# Altium project BusinessCardPCB.PrjPcb
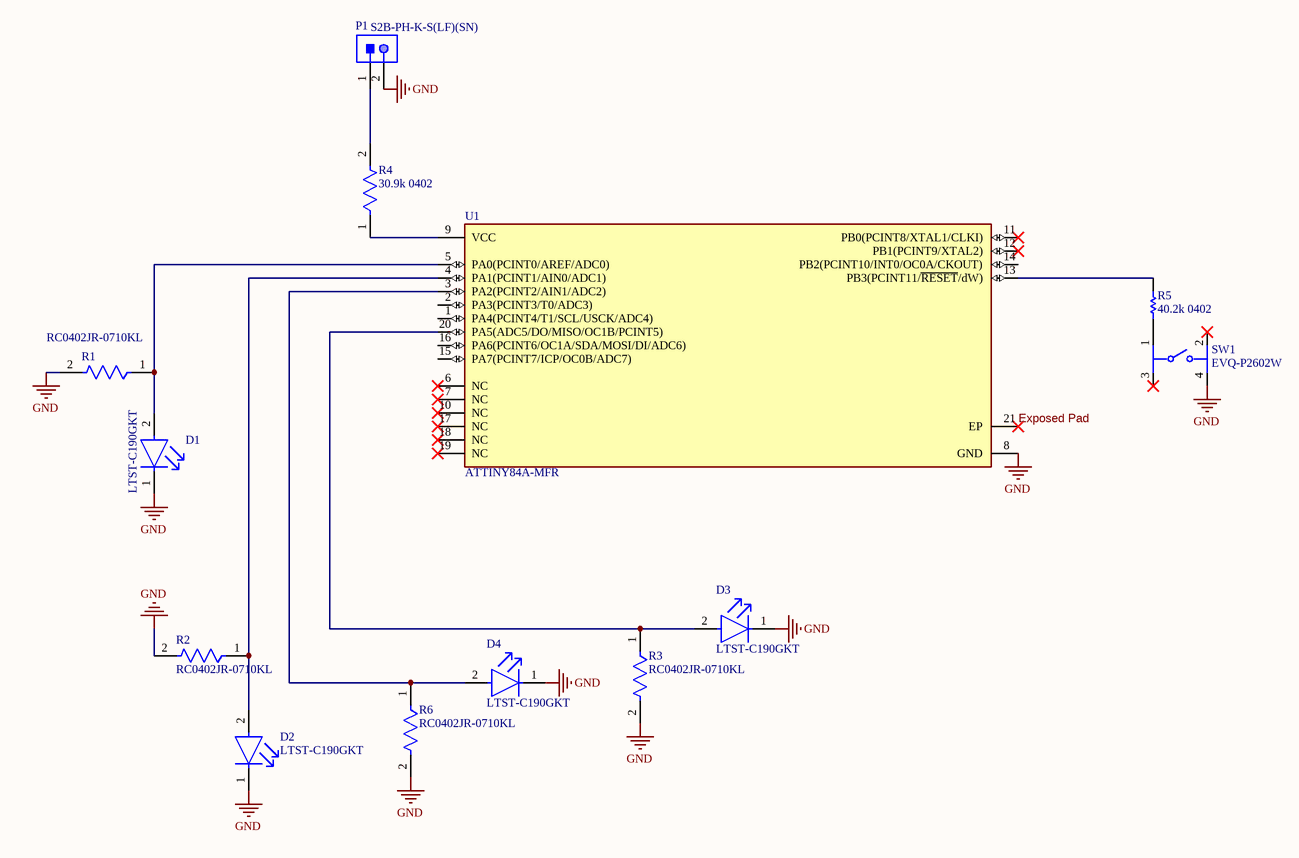
[diagram p0: BusinessCardPCB.SchDoc]
1 sheet, 13 parts. Net scope: global (net labels, ports and power ports of the same name join across sheets).
Board file: BusinessCardPCB.PcbDoc

## Sheet BusinessCardPCB.SchDoc
size A2; SheetNumber: 1; SheetTotal: 1

### Parts
D1  LTST-C190GKT  [FP-LTST-C190GKT-MFG]
D2  LTST-C190GKT  [FP-LTST-C190GKT-MFG]
D3  LTST-C190GKT  [FP-LTST-C190GKT-MFG]
D4  LTST-C190GKT  [FP-LTST-C190GKT-MFG]
P1  S2B-PH-K-S(LF)(SN)  [JST-S2B-PH-K-S_V]
R1  RC0402JR-0710KL  [FP-RC0402-0_4-IPC_C]
R2  RC0402JR-0710KL  [FP-RC0402-0_4-IPC_C]
R3  RC0402JR-0710KL  [FP-RC0402-0_4-IPC_C]
R4  30.9k 0402  [FP-RT0402-MFG]
R5  40.2k 0402  [RESC1005X40X25ML05T10]
R6  RC0402JR-0710KL  [FP-RC0402-0_4-IPC_C]
SW1  EVQ-P2602W  [FP-EVQ-P2602W-MFG]
U1  ATTINY84A-MFR  [FP-C04-21443-MFG]

### Nets
GND: D1.1(C) D2.1(C) D3.1(C) D4.1(C) P1.2 R1.2 R2.2 R3.2 R6.2 SW1.4 U1.8(GND)
Exposed Pad: U1.21(EP)
NetD1_2: D1.2(A) R1.1 U1.5(PA0(PCINT0/AREF/ADC0))
NetD2_2: D2.2(A) R2.1 U1.4(PA1(PCINT1/AIN0/ADC1))
NetD3_2: D3.2(A) R3.1 U1.20(PA5(ADC5/DO/MISO/OC1B/PCINT5))
NetD4_2: D4.2(A) R6.1 U1.3(PA2(PCINT2/AIN1/ADC2))
NetP1_1: P1.1 R4.2
NetR4_1: R4.1 U1.9(VCC)
NetR5_1: R5.1 SW1.1
NetR5_2: R5.2 U1.13(PB3(PCINT11/~{RESET}/dW))

Not connected (* = marked no-connect by the designer): SW1 2* 3*; U1 1(PA4(PCINT4/T1/SCL/USCK/ADC4)) 2(PA3(PCINT3/T0/ADC3)) 6(NC)* 7(NC)* 10(NC)* 11(PB0(PCINT8/XTAL1/CLKI))* 12(PB1(PCINT9/XTAL2))* 14(PB2(PCINT10/INT0/OC0A/CKOUT)) 15(PA7(PCINT7/ICP/OC0B/ADC7)) 16(PA6(PCINT6/OC1A/SDA/MOSI/DI/ADC6)) 17(NC)* 18(NC)* 19(NC)*

### Library data of the parts
D1-D4 = CMP-22017-000005-2: LED GREEN CLEAR CHIP SMD; Dominant Wavelength: 569nm; Reverse Voltage: 5V; Lens Color: Colorless; Viewing Angle: 130°; Voltage: 2V; Forward Current: 30mA; Power Dissipation: 100mW; Luminous Intensity: 6mcd; Number of LEDs: 1; Forward Voltage: 2.1V; Wavelength: 565nm; Test Current: 10mA; Min Operating Temperature: -55°C; Lens Style: Clear; Mount: Surface Mount; Width: 0.8mm; Packaging: Tape and Reel; Lens Transparency: Clear; Case Code (Metric): 1608; Depth: 0.8mm; Case Code (Imperial): 0603; Case/Package: 0603; Number of Pins: 2; Max Operating Temperature: 85°C; Lead Free: Lead Free; Number of Elements: 1; Length: 1.6mm; Height: 0.8mm; Package Quantity: 1; Power Rating: 100mW; Radiation Hardening: No; Illumination Color: Green; Color: Green
P1 = CMP-1755-00004-1: Male Header, Pitch 2 mm, 1 x 2 Position, Height 4.8 mm, Tail Length 3.4 mm, -25 to 85 degC, RoHS, Bulk; Case\Package: Radial; Tolerance: 20%; Capacitance: 10 uF; Voltage Rating (DC): 50 V; Packaging: Bulk; ComponentLink1URL: http://www.jst-mfg.com/product/pdf/eng/ePH.pdf; Radiation Hardening: No; Height: 11 mm; Package Quantity: 200; PackageDescription: Male Header, Pitch 2 mm, 1 x 2 Position, Height 4.8 mm, Tail Length 3.4 mm; PackageReference: S2B-PH-K-S; Diameter: 5 mm; Pins: 2; Mount: Through Hole; Max Operating Temperature: 85 degC; Min Operating Temperature: -40 degC; ComponentLink1Description: Datasheet; DatasheetVersion: Dec-12; Length: 11 mm; Lead Pitch: 2 mm; REACH SVHC: No SVHC; Voltage Rating: 50 V; RoHSCompliant: true
R1-R3 R6 = CMP-2002-07915-3: RES 10K OHM 5% 1/16W 0402; Max Power Dissipation: 63mW; Temperature Coefficient: 100ppm/°C; Power Rating: 62.5mW; Resistance: 10kR; Voltage Rating: 50V; Size Code: 0402; Resistance Tolerance: 5%; Packaging: Tape and Reel; Case Code (Metric): 1005; Lead Free: Lead Free; Resistor Type: Thick Film; Min Operating Temperature: -55°C; Military Standard: Not; Depth: 0.5mm; Series: RC; Case/Package: 0402; Construction: Rectangular; Number of Terminations: 2; Package Quantity: 1; Termination: SMD/SMT; Length: 0.039inch; Case Code (Imperial): 0402; Height: 0.016inch; Features: Moisture Resistant; RoHS Compliant: Yes; Max Operating Temperature: 155°C; Tolerance: 5%; Width: 0.02inch
R4 = CMP-03412-014653-1: RES SMD 30.9KOHM 0.1% 1/16W 0402; Manufacturer Part Number: RT0402BRE0730K9L; Manufacturer: Yageo; Value: 30.9KΩ; Power Rating: 0.063W; Temperature Coefficient: 50 ppm/°C; Tolerance: 0.001; Voltage Rating: 50V; Lead Free: Yes; Device Class L1: Passive Components; RoHS: TRUE; Device Class L3: Chip SMD Resistors; Package: RT0402; Automotive: No; Series: RT; Footprint Url: http://www.yageo.com/exep/pages/download/literatures/PYu-R_Mount_10.pdf; Resistance: 30.9KΩ; ComponentLink2URL: http://www.yageo.com/documents/recent/PYu-RT_1-to-0.01_RoHS_L_9.pdf; Category: Res; Height: 0.35mm; Temperature Range Low: -55°C; Device Class L2: Resistors; ComponentLink2Description: Datasheet; Composition: Thin Film; Temperature: -55°C to +155°C; Ipc Land Pattern Name: RESC10050X30; Octopart: https://octopart.com/rt0402bre0730k9l-yageo-1370119; Temperature Range High: +155°C; Digikey Description: RES SMD 30.9KOHM 0.1% 1/16W 0402
R5 = CMP-2002-07676-1: Part Number: RC0402FR-0740K2L; Manufacturer: Yageo / Phycomp
SW1 = CMP-00287-39836447-1: EVQ-P2602W Switch Tactile N.O. SPST Button J-Bend 0.02A 15VDC 3.5N SMD Automotive Embossed T/R; Switch Function: Off-Mom; Contact Current Rating: 20mA; Contact Resistance: 100mΩ; Actuator Length: 850µm; Max Voltage Rating (DC): 15V; Electrical Life: 200kcycles; Switch Travel: 250µm; Number of Positions: 2; Illumination Type: Illuminated, Non-Illuminated; Length: 3.5mm; Max Operating Temperature: 85°C; Min Operating Temperature: -40°C; Radiation Hardening: No; Height: 2.5mm; Throw Configuration: SPST; Mount: Surface Mount; Depth: 5.5mm; NexarPartId: 39836447; Width: 4.7mm; Orientation: Straight; Operating Force: 3.5N; Voltage Rating (DC): 15V; Max Current Rating: 20mA; Termination: J-Bend; Contact Plating: Gold, Silver; REACH SVHC: No SVHC; Current Rating: 20mA; RoHS: Compliant; Mechanical Life: 200kcycles; Lead Free: Lead Free
U1 = CMP-00252-77762303-1: ATTINY84A-MFR AVR, 8K FLASH 2K SRAM, 1KB EEPROM - 16MHz, 4x4WQFN, High Grade +125C, Green, T&R; RAM Size: 512B; Oscillator Type: Internal; Min Supply Voltage: 1.8V; Max Frequency: 20MHz; Number of UART Channels: 1; Number of ADC Channels: 8; Data Bus Width: 8b; Number of Timers/Counters: 3; Number of PWM Channels: 4; Peripherals: Brown-out Detect/Reset, POR, PWM, Temp Sensor, WDT; Number of I/Os: 12; Memory Size: 8kB; Max Supply Voltage: 5.5V; Interface: SPI; NexarPartId: 77762303; Height: 800µm; Case/Package: QFN; Lifecycle Status: Production; Memory Type: FLASH; Number of SPI Channels: 1; Min Operating Temperature: -40°C; Ambient Temperature Range High: 125°C; Core Architecture: AVR; Number of I2C Channels: 1; RoHS: Compliant; Frequency: 20MHz; Number of A/D Converters: 1; Max Operating Temperature: 85°C